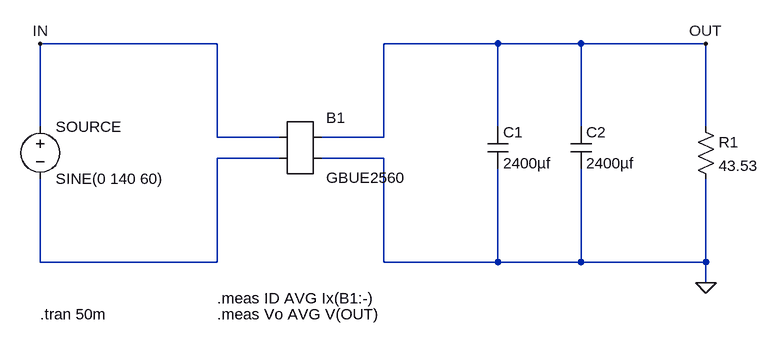
[diagram p0: schematic Full_Wave_Rectifier.asc]
Full_Wave_Rectifier.asc, the LTspice schematic file:
Version 4
SHEET 1 1300 680
WIRE -1120 -48 -1392 -48
WIRE -688 -48 -864 -48
WIRE -560 -48 -688 -48
WIRE -368 -48 -560 -48
WIRE -1392 80 -1392 -48
WIRE -688 80 -688 -48
WIRE -560 80 -560 -48
WIRE -368 80 -368 -48
WIRE -1120 96 -1120 -48
WIRE -1024 96 -1120 96
WIRE -864 96 -864 -48
WIRE -864 96 -960 96
WIRE -1024 128 -1120 128
WIRE -864 128 -960 128
WIRE -1392 288 -1392 160
WIRE -1120 288 -1120 128
WIRE -1120 288 -1392 288
WIRE -864 288 -864 128
WIRE -688 288 -688 144
WIRE -688 288 -864 288
WIRE -560 288 -560 144
WIRE -560 288 -688 288
WIRE -368 288 -368 160
WIRE -368 288 -560 288
WIRE -368 320 -368 288
FLAG -1392 -48 IN
FLAG -368 -48 OUT
FLAG -368 320 0
SYMBOL voltage -1392 64 R0
WINDOW 123 0 0 Left 0
WINDOW 39 0 0 Left 0
SYMATTR InstName SOURCE
SYMATTR Value SINE(0 140 60)
SYMBOL cap -704 80 R0
SYMATTR InstName C1
SYMATTR Value 2400µf
SYMATTR SpiceLine V=400 Rser=63m
SYMBOL res -384 64 R0
SYMATTR InstName R1
SYMATTR Value 43.53
SYMBOL AutoGenerated\\GBUE2560 -992 112 R0
SYMATTR InstName B1
SYMBOL cap -576 80 R0
SYMATTR InstName C2
SYMATTR Value 2400µf
SYMATTR SpiceLine V=400 Rser=63m
TEXT -1392 368 Left 2 !.tran 50m
TEXT -1120 344 Left 2 !.meas ID AVG Ix(B1:-)
TEXT -1120 368 Left 2 !.meas Vo AVG V(OUT)

The netlist it stands for:
* Full_Wave_Rectifier.asc
V§SOURCE IN N001 SINE(0 140 60)
C1 OUT 0 2400µf V=400 Rser=63m
R1 OUT 0 43.53
* B1: GBUE2560 (symbol AutoGenerated\GBUE2560 not available, pins judged from their places): pin1=IN pin2=N001 pin3=OUT pin4=0
C2 OUT 0 2400µf V=400 Rser=63m
.tran 50m
.meas ID AVG Ix(B1:-)
.meas Vo AVG V(OUT)
.backanno
.end